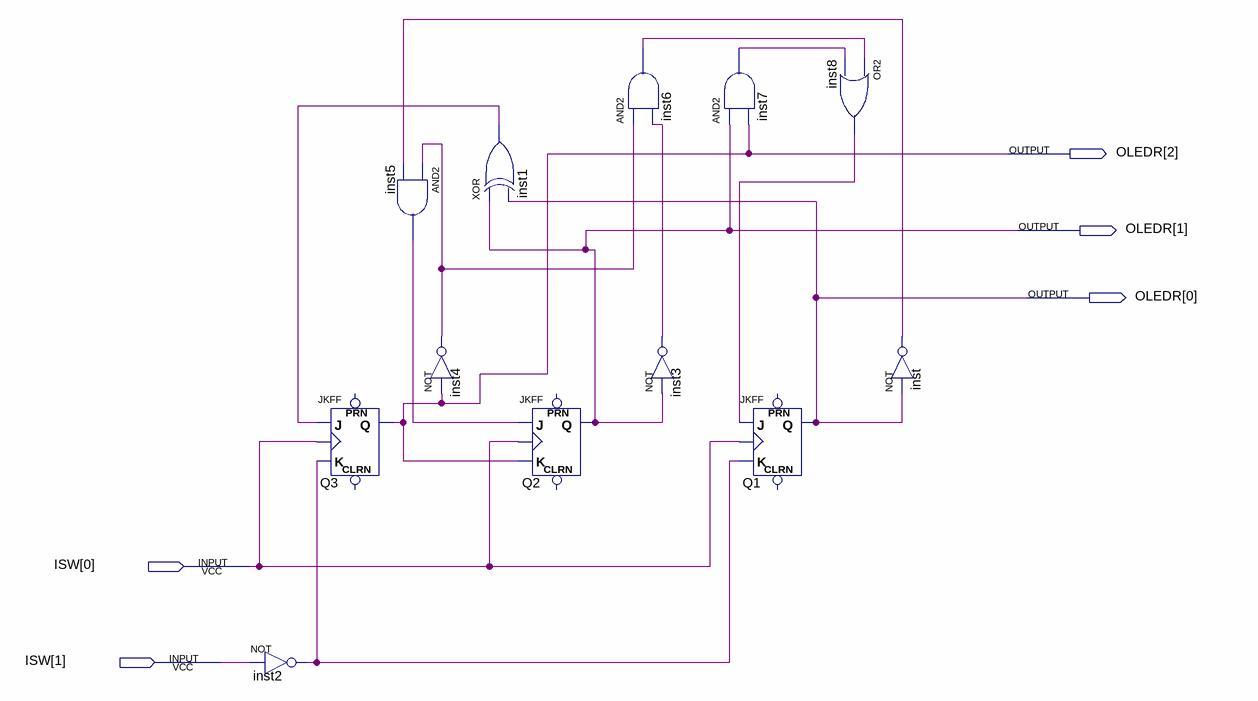
[diagram p0: schematic sheet]
// Quartus schematic Lab2.bdf as structural Verilog: 12 symbols, 5 pins
module Lab2 (
  input  [1:0] ISW,
  output [2:0] OLEDR
);

  wire inst1_out, inst2_out, inst3_out, inst4_out, inst5_out, inst6_out, inst7_out, inst8_out, inst_out;

  not inst2 (inst2_out, ISW[1]);
  JKFF Q3 (.K(inst2_out), .J(inst1_out), .CLK(ISW[0]), .Q(OLEDR[2]));  // open: PRN, CLRN
  and inst5 (inst5_out, inst4_out, inst_out);
  xor inst1 (inst1_out, OLEDR[1], OLEDR[0]);
  not inst4 (inst4_out, OLEDR[2]);
  JKFF Q2 (.K(OLEDR[2]), .J(inst5_out), .CLK(ISW[0]), .Q(OLEDR[1]));  // open: PRN, CLRN
  and inst6 (inst6_out, inst4_out, inst3_out);
  and inst7 (inst7_out, OLEDR[1], OLEDR[2]);
  not inst3 (inst3_out, OLEDR[1]);
  JKFF Q1 (.K(inst2_out), .J(inst8_out), .CLK(ISW[0]), .Q(OLEDR[0]));  // open: PRN, CLRN
  or inst8 (inst8_out, inst6_out, inst7_out);
  not inst (inst_out, OLEDR[0]);
endmodule
